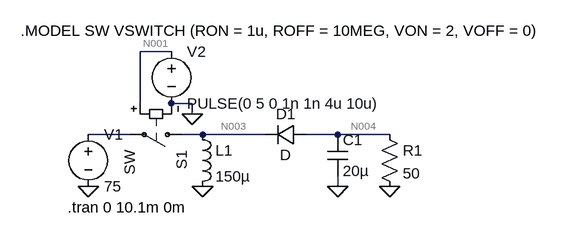
[diagram p0: schematic buck-boost.asc]
buck-boost.asc, the LTspice schematic file:
Version 4
SHEET 1 880 680
WIRE 96 -16 48 -16
WIRE 48 64 48 -16
WIRE 128 64 96 64
WIRE 128 80 128 64
WIRE 32 112 -32 112
WIRE 144 112 112 112
WIRE 240 112 144 112
WIRE 352 112 304 112
WIRE 432 112 352 112
WIRE 352 192 352 176
FLAG 144 192 0
FLAG 352 192 0
FLAG 432 192 0
FLAG -32 192 0
FLAG 128 80 0
SYMBOL ind 128 96 R0
SYMATTR InstName L1
SYMATTR Value 150µ
SYMBOL res 416 96 R0
SYMATTR InstName R1
SYMATTR Value 50
SYMBOL cap 336 112 R0
SYMATTR InstName C1
SYMATTR Value 20µ
SYMBOL diode 304 96 R90
WINDOW 0 0 32 VBottom 0
WINDOW 3 32 32 VTop 0
SYMATTR InstName D1
SYMBOL voltage -32 96 R0
WINDOW 123 0 0 Left 0
WINDOW 39 0 0 Left 0
SYMATTR InstName V1
SYMATTR Value 75
SYMBOL voltage 96 -32 R0
WINDOW 123 0 0 Left 0
WINDOW 39 0 0 Left 0
SYMATTR InstName V2
SYMATTR Value PULSE(0 5 0 1n 1n 4u 10u)
SYMBOL sw 128 112 R90
SYMATTR InstName S1
TEXT -64 224 Left 0 !.tran 0 10.1m 0m
TEXT -136 -48 Left 0 !.MODEL SW VSWITCH (RON = 1u, ROFF = 10MEG, VON = 2, VOFF = 0)

The netlist it stands for:
* buck-boost.asc
L1 N003 0 150µ
R1 N004 0 50
C1 N004 0 20µ
D1 N004 N003 D
V1 N002 0 75
V2 N001 0 PULSE(0 5 0 1n 1n 4u 10u)
S1 N003 N002 N001 0 SW
.model D D
.lib standard.dio
.tran 0 10.1m 0m
.MODEL SW VSWITCH (RON = 1u, ROFF = 10MEG, VON = 2, VOFF = 0)
.backanno
.end

* Results of the author's LTspice run, read from the files saved beside the schematic
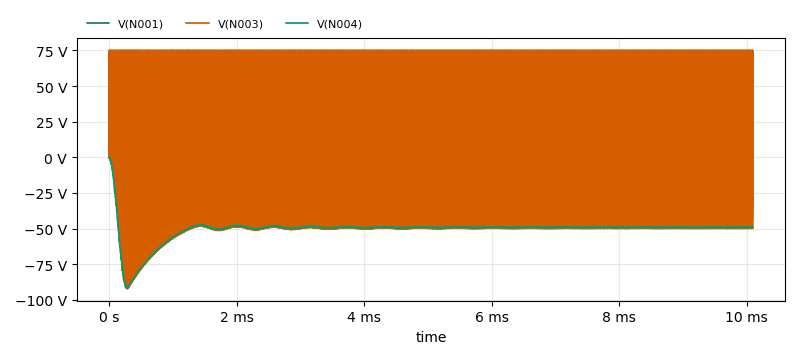
[diagram p1: Transient Analysis of buck-boost.asc, plotted from the saved traces]
* Transient Analysis, 1 run:
*   V(N001): min 0 V, max 5 V, average 2.001 V, rms 3.163 V, last 0 V
*   V(N003): min -92.65 V, max 75.02 V, average 76.47 mV, rms 61.75 V, last -50.05 V
*   V(N004): min -91.8 V, max 0 V, average -50.74 V, rms 51.43 V, last -49.23 V